# EAGLE design untitled2 (EAGLE 6.5.0)
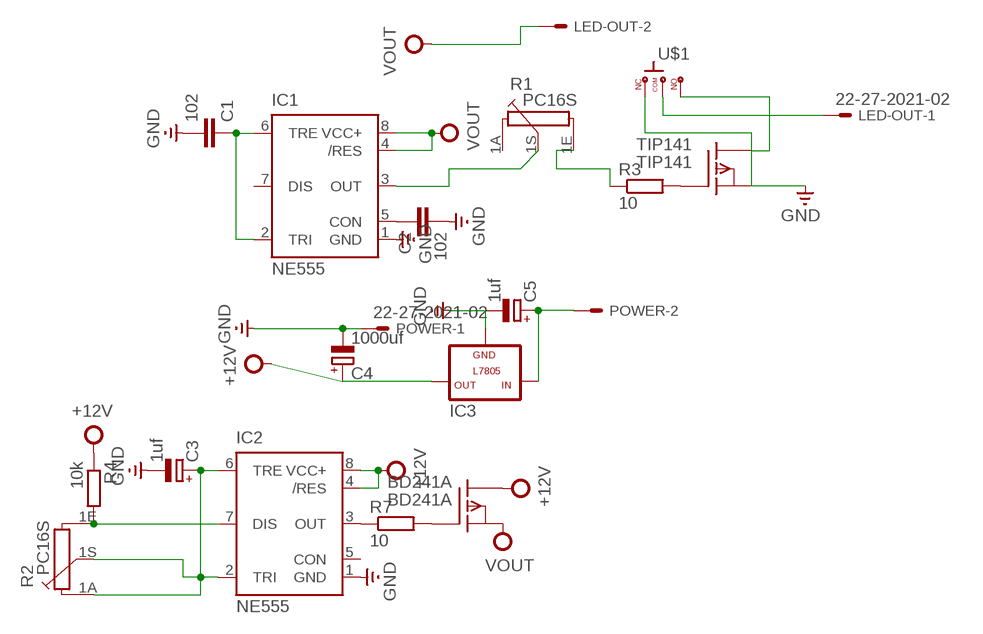
[diagram p0: schematic, sheet 1]

## Parts
BD241A  BD241A  BUZ171  [TO220]
C1  102  C-EU050-024X044  [C050-024X044]
C2  102  C-EU050-024X044  [C050-024X044]
C3  1uf  CPOL-EUE5-4  [E5-4]
C4  1000uf  CPOL-EUE5-4  [E5-4]
C5  1uf  CPOL-EUE5-4  [E5-4]
IC1  NE555  [DIL-08]
IC2  NE555  [DIL-08]
IC3  L7805  [78XXL]
LED-OUT  22-27-2021-02  [6410-02]
POWER  22-27-2021-02  [6410-02]
R1  PC16S  [PC16S]
R2  PC16S  [PC16S]
R3  10  R-EU_0207/7  [0207/7]
R4  10k  R-EU_0207/7  [0207/7]
R7  10  R-EU_0207/7  [0207/7]
TIP141  TIP141  BUZ171  [TO220]
U$1  -SLIDERS  [CON3]

## Nets
+12V: BD241A.2(D) C4.+ IC2.4(/RES) IC2.8(VCC+) IC3.OUT R4.1
GND: C1.2 C2.2 C3.- C4.- C5.- IC1.1(GND) IC2.1(GND) IC3.GND POWER.1 TIP141.3(S) U$1.P$1
N$1: IC1.3(OUT) R1.1S
N$2: LED-OUT.1 U$1.P$2
N$3: R1.1E R3.1
N$4: C2.1 IC1.5(CON)
N$6: BD241A.1(G) R7.2
N$7: IC2.3(OUT) R7.1
N$8: R3.2 TIP141.1(G)
N$9: C1.1 IC1.2(TRI) IC1.6(TRE)
N$10: C5.+ IC3.IN POWER.2
N$12: TIP141.2(D) U$1.P$3
N$13: C3.+ IC2.2(TRI) IC2.6(TRE) R2.1A R2.1S
N$14: IC2.7(DIS) R2.1E R4.2
VOUT: BD241A.3(S) IC1.4(/RES) IC1.8(VCC+) LED-OUT.2
Unconnected: IC1.7(DIS) IC2.5(CON) R1.1A

## Library data of the parts
BD241A TIP141 = transistor-fet+irf7201:BUZ171: P-Channel Enhancement MOSFET -50V; 7A; 0,4Ohm
C1 C2 = rcl 2:C-EU: CAPACITOR, European symbol
C3-C5 = rcl-2:CPOL-EU: POLARIZED CAPACITOR, European symbol
IC1 IC2 = st-microelectronics 2:NE555: General purpose bipolar Timer
IC3 = tango:L7805: VOLTAGE REGULATOR
LED-OUT POWER = con-molex 2:22-?-02: CONNECTOR wire to board 2.54 mm (.1 inch) pitch header
R1 R2 = piher 2:PC16S: POTENTIOMETER single carbon potentiometer, 16 mm, S3ROH
R3 R4 R7 = rcl-2:R-EU_: RESISTOR, European symbol
U$1 = tango:-SLIDERS

## Board
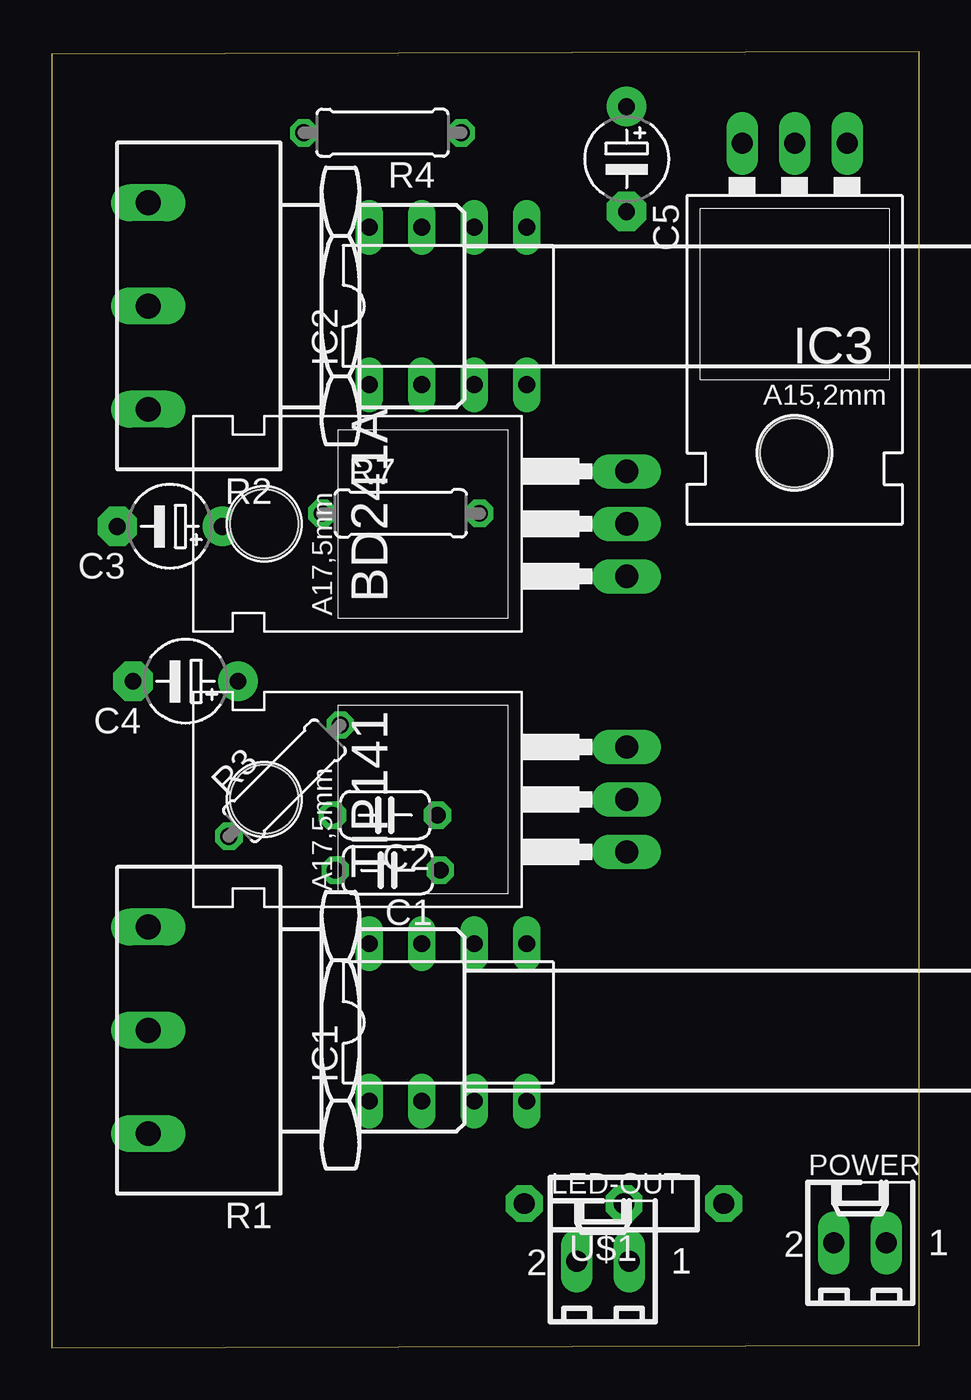
[diagram p1: board, top side]
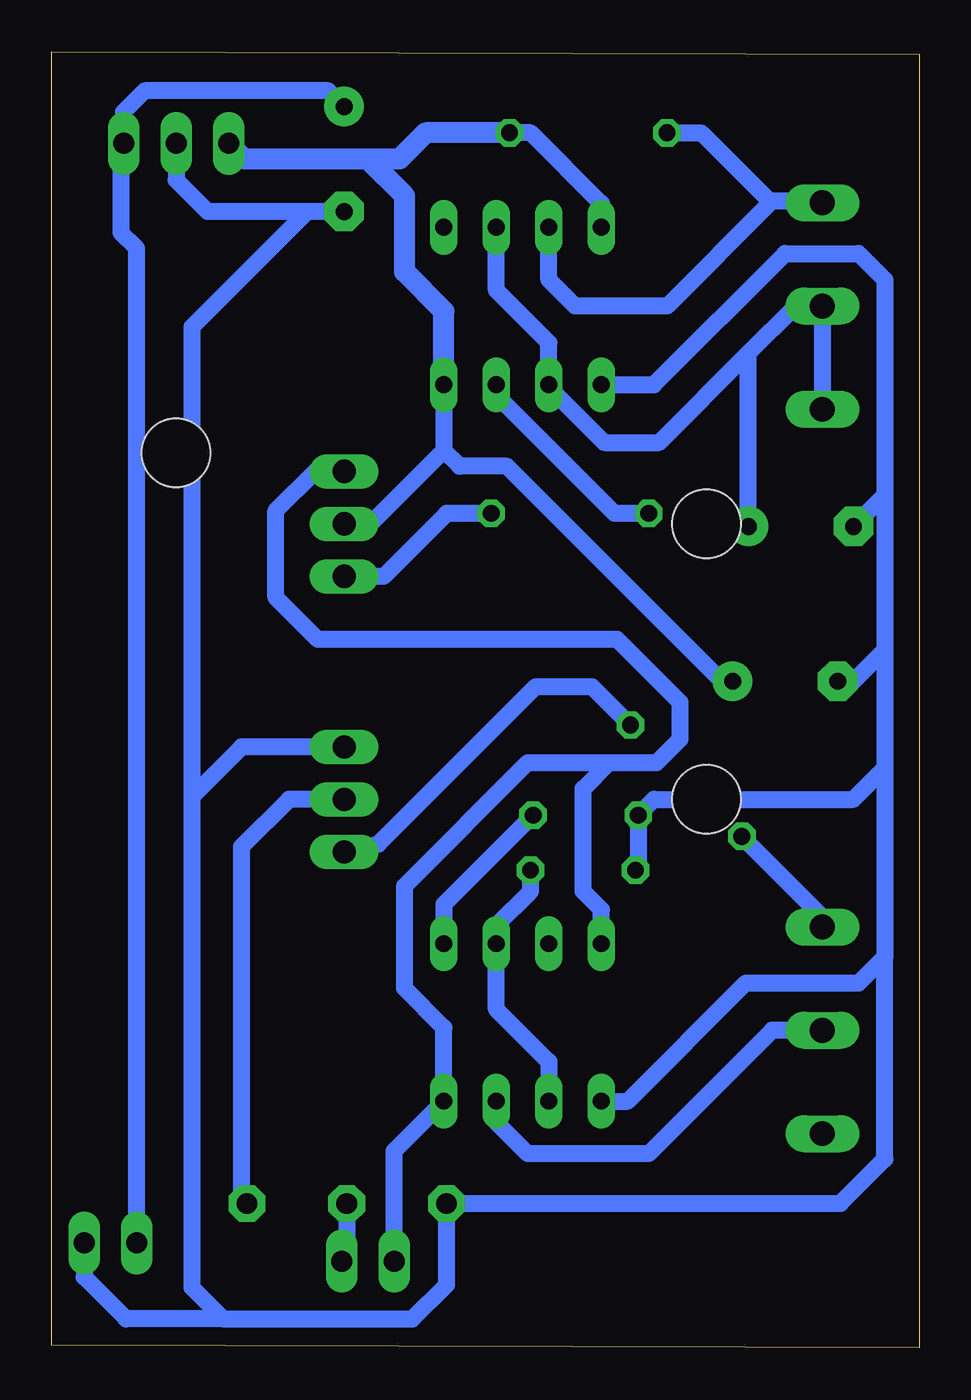
[diagram p2: board, bottom side, seen from below]

Size 41.96 x 62.73 mm. Coordinates in mm from the lower left corner, seen from the top.
Outline: 0,0 41.96,0.13 41.96,62.73 0,62.6 0,0
Copper layers (1*16): Top 0.035mm / dielectric 1.5mm / Bottom 0.035mm
Design rules "default": minimum track width 10mil, minimum drill 24mil, track to track 8mil, track to pad 8mil, pad to pad 8mil, via to via 8mil, smd to smd 8mil, copper to edge 40mil, drill to drill 8mil, minimum pad ring 10mil, minimum via ring 8mil, stop-mask expansion 4mil, vias tented up to drill 0mil, thermal gap 10mil

### Footprints (pad centres in the part's own frame; a part is rotated, then mirrored left to right if it is on the bottom)
TO220 = drill 1.118 long: 1 -2.54,-6.35; 2 0,-6.35; 3 2.54,-6.35 | hole 3.302: 0,11.176
C050-024X044 = drill 0.813 octagon: 1 -2.54,0; 2 2.54,0
E5-4 = drill 0.813 pad 1.905: + -2.54,0 | drill 0.813 pad 1.905 octagon: - 2.54,0
DIL-08 = drill 0.813 long: 1 -3.81,-3.81; 2 -1.27,-3.81; 3 1.27,-3.81; 4 3.81,-3.81; 5 3.81,3.81; 6 1.27,3.81; 7 -1.27,3.81; 8 -3.81,3.81
78XXL = drill 1.016 long: GND 0,-3.81; IN -2.54,-3.81; OUT 2.54,-3.81 | hole 3.302: 0,11.176
6410-02 = drill 1.016 long: 1 1.27,0; 2 -1.27,0
PC16S = drill 1.2 long: 1A -5,6.5; 1E 5,6.5; 1S 0,6.5
0207/7 = drill 0.813 octagon: 1 -3.81,0; 2 3.81,0
CON3 = drill 1 pad 1.778 octagon: P$1 -5.334,0.254; P$2 -0.508,0.254; P$3 4.318,0.254

### Placement (x,y rotation side)
BD241A  21.46,39.88 90 top
C1  16.26,23.11 180 top
C2  16.13,25.78 180 top
C3  5.71,39.75 180 top
C4  6.48,32.26 180 top
C5  27.81,57.53 270 top
IC1  19.18,15.75 0 top
IC2  19.18,50.42 0 top
IC3  35.94,54.48 180 top
LED-OUT  26.67,4.19 0 top
POWER  39.12,5.08 0 top
R1  11.18,15.37 90 top
R2  11.18,50.42 90 top
R3  11.27,27.45 45 top
R4  16,58.8 180 top
R7  16.89,40.39 0 top
TIP141  21.46,26.54 90 top
U$1  28.19,6.73 0 top

### Tracks (layer width: path | path; a pad name or v marks a point on that pad's centre or on a via)
+12V
  Bottom 0.813: IC2.8 15.37,55.37 18.8,58.8 R4.1 | IC2.4 22.99,43.43 | 22.99,43.43 26.54,39.88 BD241A.2 | 22.99,43.43 22.23,42.67 19.94,42.67 9.53,32.26 C4.+
  Bottom 1.016: R4.1 23.88,58.8 25.15,57.53 26.67,57.53 | 26.67,57.53 32.64,57.53 IC3.OUT | IC2.4 22.99,50.16 24.89,52.07 24.89,55.75 26.67,57.53
GND
  Bottom 0.813: IC1.1 14.1,11.94 8.38,17.65 2.92,17.65 1.65,18.92 | 1.65,41.27 1.65,51.69 2.92,52.96 6.48,52.96 12.83,46.61 IC2.1 | 1.65,41.27 1.65,33.78 | 1.65,33.78 1.65,28.07 | 1.65,28.07 1.65,18.92 | 1.65,18.92 1.65,9.14 3.81,6.98 U$1.P$1 22.86,3.05 24.51,1.4 33.66,1.4 | C5.- 29.59,54.99 | 29.59,54.99 34.42,54.99 35.94,56.52 IC3.GND | C3.- 1.65,41.27 | C1.2 13.59,23.24 C2.2 12.83,26.54 3.17,26.54 1.65,28.07 | 35.18,26.67 35.18,49.4 29.59,54.99 | 35.18,26.67 35.18,2.92 33.66,1.4 | POWER.1 40.39,3.43 38.35,1.4 33.66,1.4 | TIP141.3 32.77,29.08 35.18,26.67 | C4.- 3.17,32.26 1.65,33.78
N$1
  Bottom 0.813: IC1.3 20.45,10.92 18.92,9.4 13.08,9.4 7.11,15.37 R1.1S
N$2
  Bottom 0.813: U$1.P$2 27.69,4.45 LED-OUT.1
N$3
  Bottom 0.813: R1.1E 4.68,20.86 R3.1
N$4
  Bottom 0.813: 22.99,20.32 IC1.5 22.99,21.46 C2.1
N$6
  Bottom 0.813: R7.2 22.86,40.39 25.91,37.34 BD241A.1
N$7
  Bottom 0.813: R7.1 14.73,40.39 20.45,46.1 IC2.3
N$8
  Bottom 0.813: TIP141.1 26.16,24.38 18.54,32 15.82,32 R3.2
N$9
  Bottom 0.813: IC1.2 17.91,13.84 20.45,16.38 IC1.6 20.45,20.45 18.8,22.1 C1.1
N$10
  Bottom 0.813: C5.+ 28.58,60.83 37.47,60.83 38.48,59.82 IC3.IN 38.61,58.17 38.61,53.98 37.85,53.21 POWER.2
N$12
  Bottom 0.813: TIP141.2 30.48,26.54 32.77,24.26 32.77,7.24 U$1.P$3
N$13
  Bottom 0.813: IC2.6 20.45,51.18 17.91,48.64 IC2.2 17.91,46.48 15.24,43.82 12.57,43.82 8.25,48.13 | R2.1A R2.1S 5.97,50.42 8.25,48.13 | C3.+ 8.25,48.13
N$14
  Bottom 0.813: R2.1E 4.57,55.42 4.57,55.5 | IC2.7 17.91,51.69 16.64,50.42 12.19,50.42 7.17,55.44 | 7.17,55.44 7.11,55.5 4.57,55.5 | 4.5,55.5 4.57,55.5 | R4.2 10.54,58.8 7.17,55.44
S$11  (1 unrouted)
VOUT
  Bottom 0.813: IC1.4 22.99,15.49 24.89,17.4 24.89,22.35 18.92,28.32 14.99,28.32 | IC1.4 22.99,11.68 | BD241A.3 29.21,42.42 31.12,40.51 31.12,36.32 29.08,34.29 14.6,34.29 11.56,31.24 11.56,29.46 12.7,28.32 14.99,28.32 | IC1.8 15.37,21.21 16.26,22.1 16.26,27.05 14.99,28.32 | LED-OUT.2 25.4,9.53 IC1.4